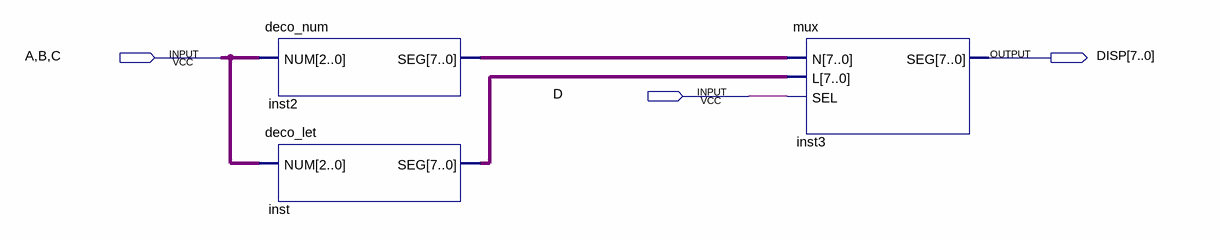
[diagram p0: schematic sheet]
// Quartus schematic practica02.bdf as structural Verilog: 3 symbols, 3 pins
module practica02 (
  input  A,
  input  B,
  input  C,
  input  D,
  output [7:0] DISP
);

  wire [7:0] inst2_seg, inst_seg;

  deco_num inst2 (.NUM({A, B, C}), .SEG(inst2_seg));
  deco_let inst (.NUM({A, B, C}), .SEG(inst_seg));
  mux inst3 (.N(inst2_seg), .L(inst_seg), .SEL(D), .SEG(DISP));
endmodule
